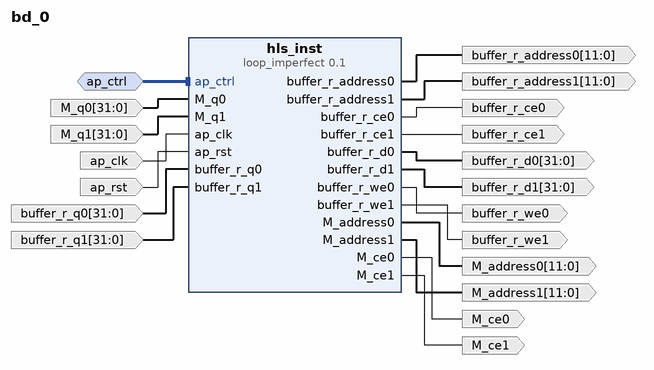
[diagram p0: block diagram of the top level]
# Vivado block design bd_0, xc7k160tfbg484-1, Vivado 2019.2
create_bd_design bd_0

create_bd_intf_port -mode Slave -vlnv xilinx.com:interface:acc_handshake_rtl:1.0 ap_ctrl
create_bd_port -dir O -from 11 -to 0 -type data M_address0
create_bd_port -dir O -from 11 -to 0 -type data M_address1
create_bd_port -dir O M_ce0
create_bd_port -dir O M_ce1
create_bd_port -dir I -from 31 -to 0 -type data M_q0
create_bd_port -dir I -from 31 -to 0 -type data M_q1
create_bd_port -dir I -type clk ap_clk
set_property -dict {CONFIG.FREQ_HZ 250000000.0} [get_bd_ports ap_clk]
create_bd_port -dir I -type rst ap_rst
set_property -dict {CONFIG.POLARITY ACTIVE_HIGH} [get_bd_ports ap_rst]
create_bd_port -dir O -from 11 -to 0 -type data buffer_r_address0
create_bd_port -dir O -from 11 -to 0 -type data buffer_r_address1
create_bd_port -dir O buffer_r_ce0
create_bd_port -dir O buffer_r_ce1
create_bd_port -dir O -from 31 -to 0 -type data buffer_r_d0
create_bd_port -dir O -from 31 -to 0 -type data buffer_r_d1
create_bd_port -dir I -from 31 -to 0 -type data buffer_r_q0
create_bd_port -dir I -from 31 -to 0 -type data buffer_r_q1
create_bd_port -dir O buffer_r_we0
create_bd_port -dir O buffer_r_we1

create_bd_cell -type ip -vlnv xilinx.com:hls:loop_imperfect:0.1 hls_inst

# ---- connections ----

connect_bd_intf_net -intf_net ap_ctrl_0_1 [get_bd_intf_ports ap_ctrl] [get_bd_intf_pins hls_inst/ap_ctrl]
connect_bd_net [get_bd_pins hls_inst/M_address0] [get_bd_ports M_address0]
connect_bd_net [get_bd_pins hls_inst/M_address1] [get_bd_ports M_address1]
connect_bd_net [get_bd_pins hls_inst/M_ce0] [get_bd_ports M_ce0]
connect_bd_net [get_bd_pins hls_inst/M_ce1] [get_bd_ports M_ce1]
connect_bd_net -net M_q0_0_1 [get_bd_ports M_q0] [get_bd_pins hls_inst/M_q0]
connect_bd_net -net M_q1_0_1 [get_bd_ports M_q1] [get_bd_pins hls_inst/M_q1]
connect_bd_net -net ap_clk_0_1 [get_bd_ports ap_clk] [get_bd_pins hls_inst/ap_clk]
connect_bd_net -net ap_rst_0_1 [get_bd_ports ap_rst] [get_bd_pins hls_inst/ap_rst]
connect_bd_net [get_bd_pins hls_inst/buffer_r_address0] [get_bd_ports buffer_r_address0]
connect_bd_net [get_bd_pins hls_inst/buffer_r_address1] [get_bd_ports buffer_r_address1]
connect_bd_net [get_bd_pins hls_inst/buffer_r_ce0] [get_bd_ports buffer_r_ce0]
connect_bd_net [get_bd_pins hls_inst/buffer_r_ce1] [get_bd_ports buffer_r_ce1]
connect_bd_net [get_bd_pins hls_inst/buffer_r_d0] [get_bd_ports buffer_r_d0]
connect_bd_net [get_bd_pins hls_inst/buffer_r_d1] [get_bd_ports buffer_r_d1]
connect_bd_net -net buffer_r_q0_0_1 [get_bd_ports buffer_r_q0] [get_bd_pins hls_inst/buffer_r_q0]
connect_bd_net -net buffer_r_q1_0_1 [get_bd_ports buffer_r_q1] [get_bd_pins hls_inst/buffer_r_q1]
connect_bd_net [get_bd_pins hls_inst/buffer_r_we0] [get_bd_ports buffer_r_we0]
connect_bd_net [get_bd_pins hls_inst/buffer_r_we1] [get_bd_ports buffer_r_we1]

validate_bd_design
save_bd_design
